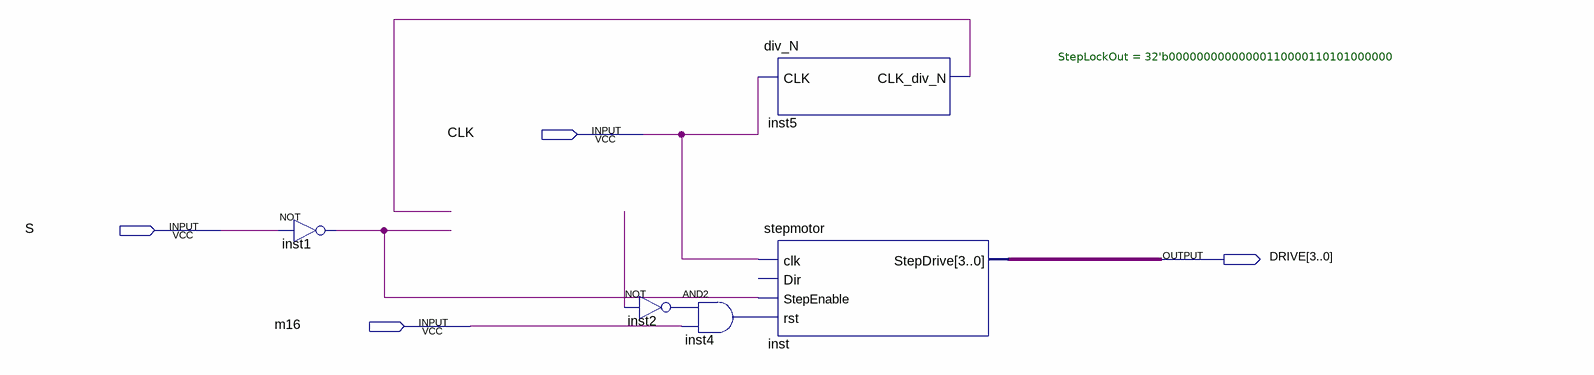
[diagram p0: schematic sheet]
// Quartus schematic zhixing.bdf as structural Verilog: 5 symbols, 4 pins
module zhixing (
  input  CLK,
  input  S,
  input  m16,
  output [3:0] DRIVE
);

  wire inst1_out, inst2_out, inst4_out, inst5_clk_div_n, undriven;

  not inst1 (inst1_out, S);
  not inst2 (inst2_out, undriven);
  and inst4 (inst4_out, inst2_out, m16);
  div_N inst5 (.CLK(CLK), .CLK_div_N(inst5_clk_div_n));
  stepmotor #(.StepLockOut(32'b00000000000000110000110101000000)) inst (
    .clk(CLK), .StepEnable(inst1_out), .rst(inst4_out), .StepDrive(DRIVE));  // open: Dir
endmodule
